# Altium schematic sheet v1.1.SchDoc
size 114 x 50 mm
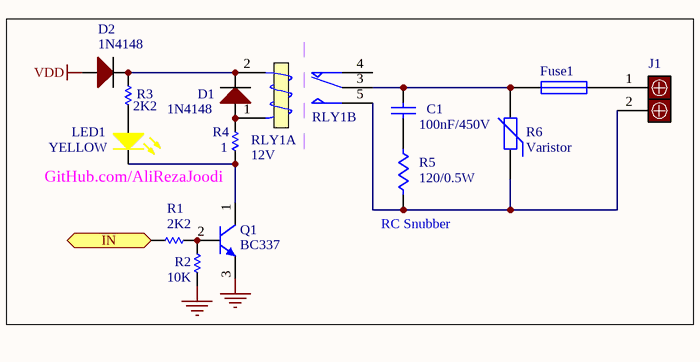
[diagram p0: v1.1.SchDoc]

## Parts
C1  100nF/450V  [C_THD_CER_(P2.54-D3.5-T1.5)]
D1  1N4148  [D_THD_AXIAL0.3_DO-35]
D2  1N4148  [D_THD_AXIAL0.3_DO-35]
Fuse1  2A  [PIN-W2/E2.8]  (value not drawn)
J1  2PIN  [Connector_Phoenix_2PIN_MSTB]  (value not drawn)
LED1  YELLOW  [LED_THD_3MM_YELLOW_R]
Q1  BC337  [TO92C]
R1  2K2  [R_THD_AXIAL0.4(1/4W)]
R2  10K  [R_THD_AXIAL0.4(1/4W)]
R3  2K2  [R_THD_AXIAL0.4(1/4W)]
R4  1  [R_THD_AXIAL0.4(1/4W)]
R5  120/0.5W  [R_THD_AXIAL0.9(3W)]
R6  Varistor  [R2012-0805]
RLY1  12V  [RELAY_SPDT_5PIN_2216]  (parts A,B of 2)

## Ports
IN (in)

## Nets
GND: Q1.3(E) R2.1
VDD: D2.1(A)
IN: R1.2 ; port IN
NetC1_1: C1.1 R5.2
NetC1_2: C1.2 Fuse1.1 R6.2 RLY1.3(COM)
NetD1_1: D1.1(A) R4.2 RLY1.1(T2)
NetD1_2: D1.2(K) D2.2(K) R3.2 RLY1.2(T1)
NetFuse1_2: Fuse1.2 J1.1
NetJ1_2: J1.2 R5.1 R6.1 RLY1.5(NO)
NetLED1_1: LED1.1(A) R3.1
NetLED1_2: LED1.2(K) Q1.1(C) R4.1
NetQ1_2: Q1.2(B) R1.1 R2.2

Not connected (* = marked no-connect by the designer): RLY1 4(NC)

## Notes on the sheet
- GitHub.com/AliRezaJoodi
- (near R5) RC Snubber

## Library data of the parts
C1 = Capacitor_Ceramic: Capacitor, Ceramic Multilayer; Revision: July-2002: Re-released for DXP Platform.
D1 D2 = Diode_2Form: Diode,; Revision: July-2002: Re-released for DXP Platform.
Fuse1 = Fuse 1: Fuse; Manufacturer: Generic Components; Class I: Passive; Published: 8-Jun-2000; Revision: July-2002: Re-released for DXP Platform.; Publisher: Altium Limited; Class II: Fuse
J1 = Connector1x2_Power: Connector, Header, 2Pin; Revision: July-2002: Re-released for DXP Platform.
LED1 = LED_YELLOW: LED, Yellow; Manufacturer: Generic Components; Class I: Optoelectronic; Published: 8-Jun-2000; Revision: July-2002: Re-released for DXP Platform.; Publisher: Altium Limited; Class II: LED
Q1 = NPN: NPN Bipolar Transistor; Manufacturer: Generic Components; Class I: Discrete; Class II: BJT - Low Power; Published: 8-Jun-2000; Revision: July-2002: Re-released for DXP Platform.; Publisher: Altium Limited
R1-R4 = Resistor: Revision: July-2002: Re-released for DXP Platform.
R5 = Resistor_3Form: Resistor; Revision: July-2002: Re-released for DXP Platform.
R6 = Res Varistor: Varistor (Voltage-Sensitive Resistor); Manufacturer: Generic Components; Class I: Discrete; Published: 24-Mar-1999; Revision: July-2002: Re-released for DXP Platform.; Publisher: Altium Limited; Class II: Voltage-Sensitive Resistor
RLY1 = Relay_SPDT_2Form: SPDT Relay